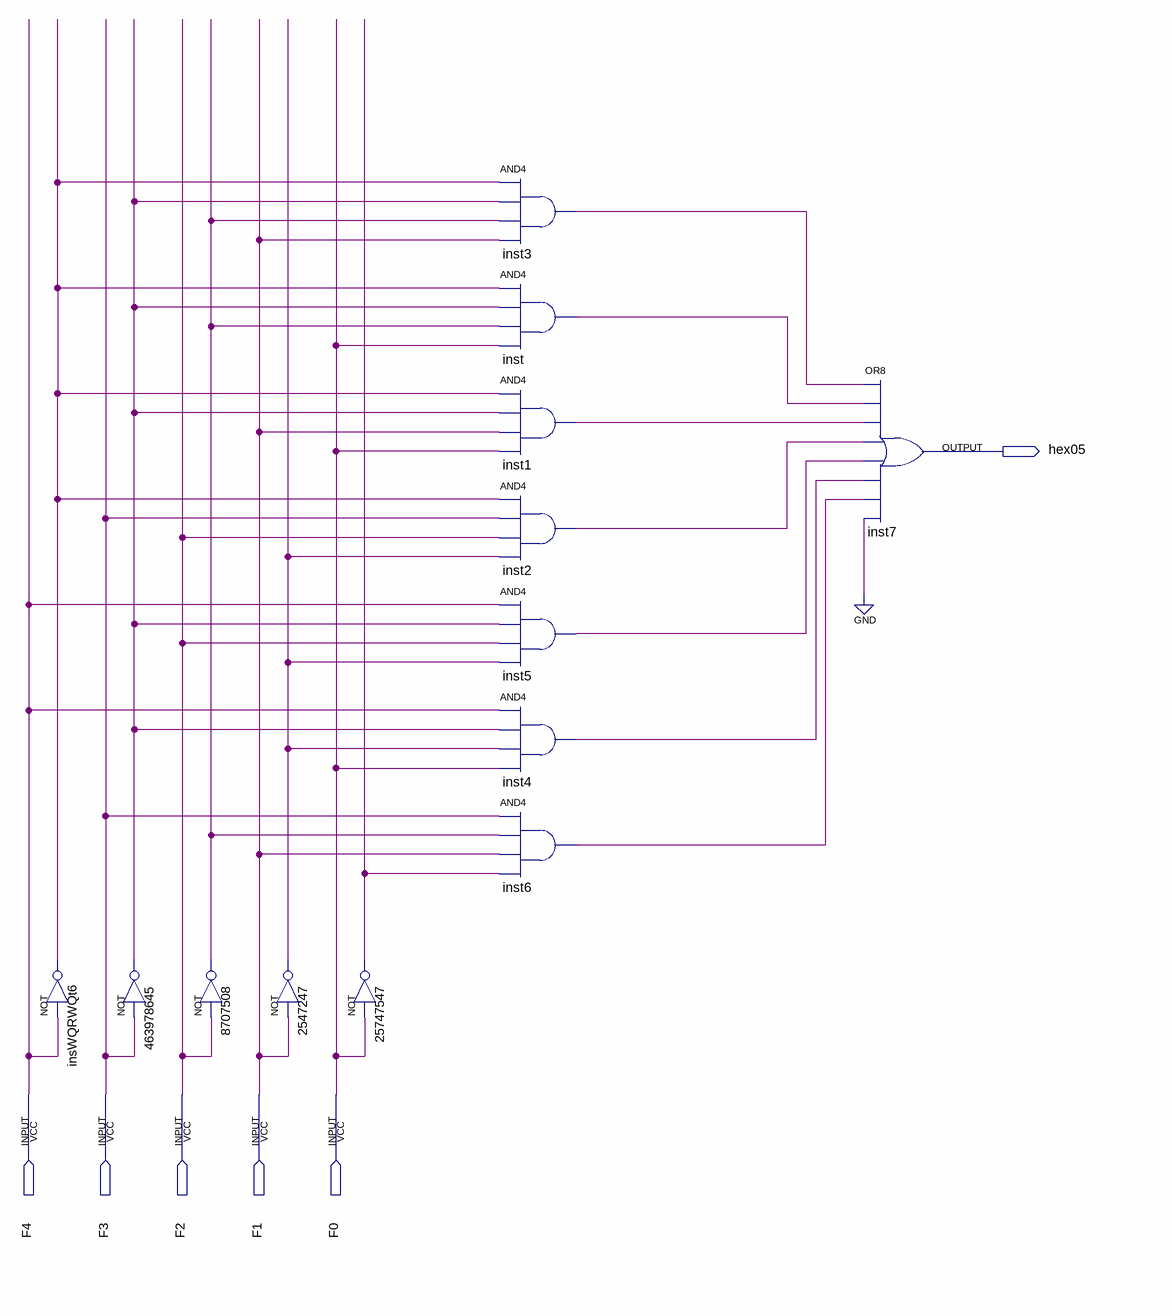
[diagram p0: schematic sheet]
// Quartus schematic HEX0[5].bdf as structural Verilog: 13 symbols, 6 pins
module \HEX0[5]  (
  input  F4,
  input  F3,
  input  F2,
  input  F1,
  input  F0,
  output hex05
);

  wire inst1_out, inst2_out, inst3_out, inst4_out, inst5_out, inst6_out, inst_out, insWQRWQt6_out,
       n2547247_out, n8707508_out, n25747547_out, n463978645_out;

  not insWQRWQt6 (insWQRWQt6_out, F4);
  not u_463978645 (n463978645_out, F3);
  not u_8707508 (n8707508_out, F2);
  not u_2547247 (n2547247_out, F1);
  not u_25747547 (n25747547_out, F0);
  and inst3 (inst3_out, insWQRWQt6_out, n463978645_out, n8707508_out, F1);
  and inst (inst_out, insWQRWQt6_out, n463978645_out, n8707508_out, F0);
  and inst1 (inst1_out, insWQRWQt6_out, n463978645_out, F1, F0);
  and inst2 (inst2_out, insWQRWQt6_out, F3, F2, n2547247_out);
  and inst5 (inst5_out, F4, n463978645_out, F2, n2547247_out);
  and inst4 (inst4_out, F4, n463978645_out, n2547247_out, F0);
  and inst6 (inst6_out, F3, n8707508_out, F1, n25747547_out);
  or inst7 (hex05, inst3_out, inst_out, inst1_out, inst2_out, inst5_out, inst4_out, inst6_out, 1'b0);
endmodule
